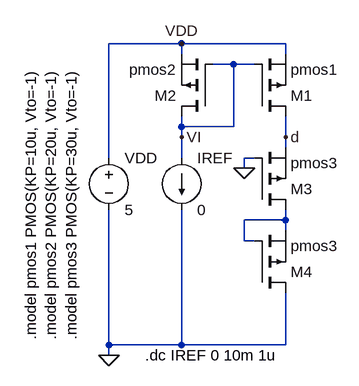
[diagram p0: schematic 16-3-9-b-1.asc]
16-3-9-b-1.asc, the LTspice schematic file:
Version 4
SHEET 1 880 680
WIRE 368 48 256 48
WIRE 528 48 368 48
WIRE 368 64 368 48
WIRE 528 64 528 48
WIRE 448 80 416 80
WIRE 480 80 448 80
WIRE 368 176 368 160
WIRE 448 176 448 80
WIRE 448 176 368 176
WIRE 368 192 368 176
WIRE 528 192 528 160
WIRE 528 208 528 192
WIRE 256 224 256 48
WIRE 368 224 368 192
WIRE 480 224 464 224
WIRE 464 240 464 224
WIRE 528 320 528 304
WIRE 528 320 464 320
WIRE 528 336 528 320
WIRE 464 352 464 320
WIRE 480 352 464 352
WIRE 256 512 256 304
WIRE 368 512 368 304
WIRE 368 512 256 512
WIRE 528 512 528 432
WIRE 528 512 368 512
WIRE 256 528 256 512
FLAG 368 48 VDD
FLAG 256 528 0
FLAG 464 240 0
FLAG 368 192 VI
FLAG 528 192 d
SYMBOL voltage 256 208 R0
WINDOW 123 0 0 Left 0
WINDOW 39 0 0 Left 0
SYMATTR InstName VDD
SYMATTR Value 5
SYMBOL pmos 480 160 M180
SYMATTR InstName M1
SYMATTR Value pmos1
SYMBOL pmos 416 160 R180
SYMATTR InstName M2
SYMATTR Value pmos2
SYMBOL pmos 480 304 M180
SYMATTR InstName M3
SYMATTR Value pmos3
SYMBOL current 368 224 R0
WINDOW 123 0 0 Left 0
WINDOW 39 0 0 Left 0
SYMATTR InstName IREF
SYMATTR Value 0
SYMBOL pmos 480 432 M180
SYMATTR InstName M4
SYMATTR Value pmos3
TEXT 136 504 VLeft 2 !.model pmos1 PMOS(KP=10u, Vto=-1)\n.model pmos2 PMOS(KP=20u, Vto=-1)\n.model pmos3 PMOS(KP=30u, Vto=-1)
TEXT 312 528 Left 2 !.dc IREF 0 10m 1u

The netlist it stands for:
* 16-3-9-b-1.asc
VDD VDD 0 5
M1 d VI VDD VDD pmos1
M2 VI VI VDD VDD pmos2
M3 N001 0 d d pmos3
IREF VI 0 0
M4 0 N001 N001 N001 pmos3
.model NMOS NMOS
.model PMOS PMOS
.lib standard.mos
.model pmos1 PMOS(KP=10u, Vto=-1)
.model pmos2 PMOS(KP=20u, Vto=-1)
.model pmos3 PMOS(KP=30u, Vto=-1)
.dc IREF 0 10m 1u
.backanno
.end